# Altium schematic sheet [03] USB.SchDoc: Design 1
size Tabloid; Engineer: The ASID Designer; Organization: ASID Designer; Address1: Iran; Address2: Shiraz; Address3: P.O.Box 71765-385; DocumentNumber: 1; Revision: 1.0; SheetNumber: 1; SheetTotal: 1
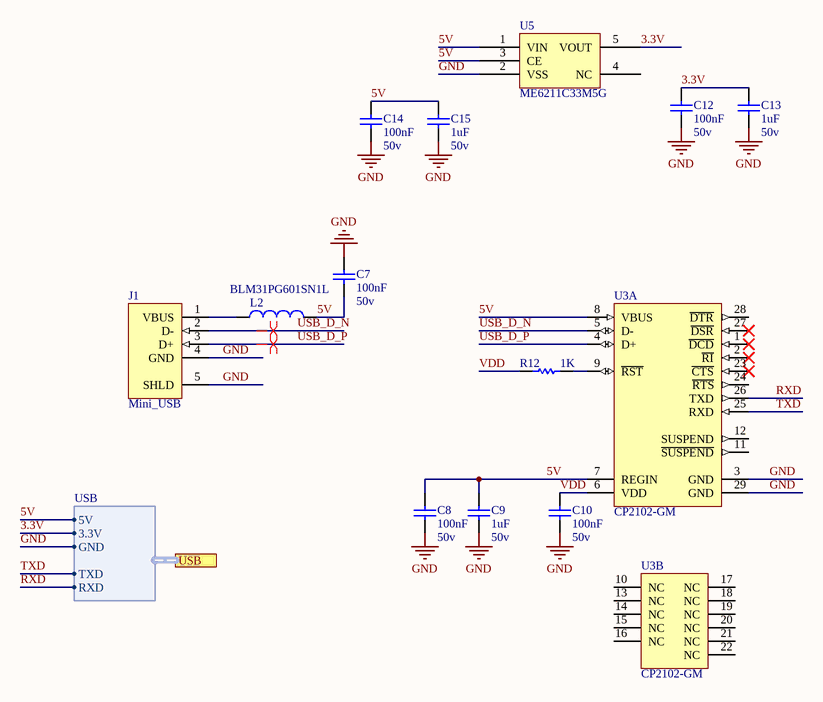
[diagram p0: [03] USB.SchDoc]

## Parts
C7  Volte: 50v  [MY_0603]  (hidden comment: 100nF)
C8  Volte: 50v  [MY_0603]  (hidden comment: 100nF)
C9  Volte: 50v  [MY_0603]  (hidden comment: 1uF)
C10  Volte: 50v  [MY_0603]  (hidden comment: 100nF)
C12  Volte: 50v  [MY_0603]  (hidden comment: 100nF)
C13  Volte: 50v  [MY_0603]  (hidden comment: 1uF)
C14  Volte: 50v  [MY_0603]  (hidden comment: 100nF)
C15  Volte: 50v  [MY_0603]  (hidden comment: 1uF)
J1  Mini_USB  [MY_Micro_USB_B]
L2  BLM31PG601SN1L  [MY_1206]
R12  1K  [MY_0603]
U3  CP2102-GM  [SLAB-QFN-28-3125x3125TP_N]  (parts A,B of 2)
U5  ME6211C33M5G  [MY_SOT23-5]

## Ports
USB (harness USB)

## Harnesses
USB: 5V, GND, TXD, RXD, 3.3V

## Nets
GND: C7.1 C8.1 C9.1 C10.1 C12.2 C13.2 C14.2 C15.1 J1.4(GND) J1.5(SHLD) U3.3(GND) U3.29(GND) U5.2(VSS) ; port USB.GND
3.3V: C12.1 C13.1 U5.5(VOUT) ; port USB.3.3V
5V: C7.2 C8.2 C9.2 C14.1 C15.2 L2.2 U3.7(REGIN) U3.8(VBUS) U5.1(VIN) U5.3(CE) ; port USB.5V
RXD: U3.26(TXD) ; port USB.RXD
TXD: U3.25(RXD) ; port USB.TXD
USB_D_N: J1.2(D-) U3.5(D-)
USB_D_P: J1.3(D+) U3.4(D+)
VDD: C10.2 R12.1 U3.6(VDD)
NetJ1_1: J1.1(VBUS) L2.1
NetR12_2: R12.2 U3.9(~{RST})

Not connected (* = marked no-connect by the designer): U3 1(~{DCD})* 2(~{RI})* 10(NC) 11(~{SUSPEND}) 12(SUSPEND) 13(NC) 14(NC) 15(NC) 16(NC) 17(NC) 18(NC) 19(NC) 20(NC) 21(NC) 22(NC) 23(~{CTS})* 24(~{RTS}) 27(~{DSR})* 28(~{DTR}); U5 4(NC)

## Layout directives
differential pair: USB_D_N, USB_D_P

## Notes on the sheet
- Title
- Engineer:
- Date:
- Ali Asadzadeh
- Time:
- Number:
- Sheet
- Revision:
- of
- www.ASiDesigner.com
- Designed In Shiraz
- ASiD Designer
- File:

## Library data of the parts
C7-C10 C12-C15 = Cap ceramic: None polar capacitor; ASiD Part Number: C-AS
  C7 C8 C10 C12 C14: Value: 100nF
  C9 C13 C15: Value: 1uF
J1 = Mini_USB: USB 2.0, Right Angle, SMT, B Type, Receptacle, 5 Position, Black; ASiD Part Number: Mini_USB-AS
L2 = Inductor: ASiD Part Number: Inductor-AS; Current: 1A; Value: BLM31PG601SN1L
R12 = Res: Standard resistor; ASiD Part Number: Res-AS; Value: 1K
U3 = CMP-0511-00012-1: Single-Chip USB to UART Bridge, 1024 Bytes EEPROM, -40 to 85 degC, 28-pin QFN, Tube; Manufacturer: Silicon Labs; Internal Oscillator: TRUE; Sub-Family: USB Bridges; ComponentLink3Description: Package Specification; PackageDescription: 28-Pin Quad-Flat No-Leads Package, Body 5 x 5 mm, Pitch 0.5 mm; PartNumber: CP2102-GM; EEPROM: 1024 Bytes; Mounting Technology: Surface Mount; ComponentLink2URL: http://www.silabs.com/Support%20Documents/TechnicalDocs/CP2102-9.pdf; DatasheetVersion: Rev. 1.5; ComponentLink1URL: http://www.silabs.com/; ComponentLink2Description: Datasheet; Code_JEDEC: MO-220; PackageReference: QFN-28; Code_IPC: J-STD-020C; ComponentLink3URL: http://www.silabs.com/Support%20Documents/TechnicalDocs/C8051T61x.pdf; ComponentLink1Description: Manufacturer URL; PartId: 1
U5 = ME6211C33M5G: High Speed LDO Regulators, High PSRR, Low noise